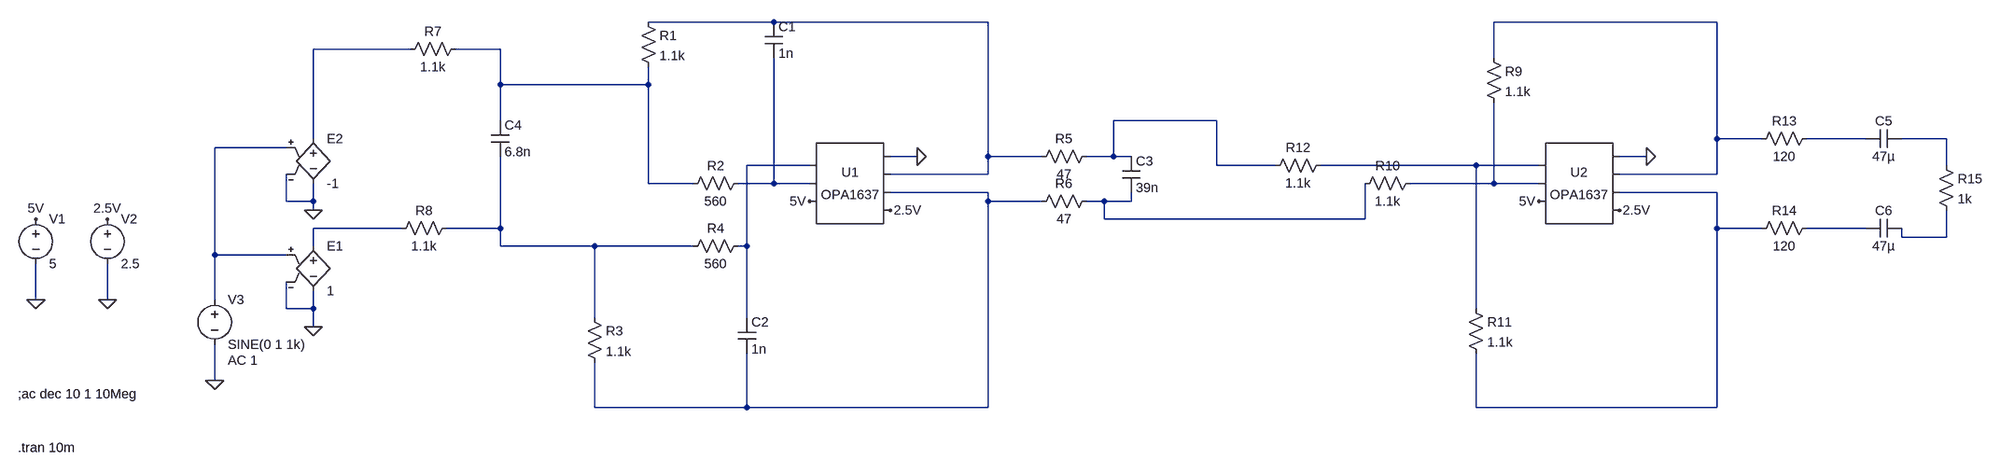
[diagram p0: schematic diff_amp_sim_output1.asc]
diff_amp_sim_output1.asc, the LTspice schematic file:
Version 4
SHEET 1 2404 680
WIRE 32 -112 -192 -112
WIRE 416 -112 32 -112
WIRE 1888 -112 1488 -112
WIRE -800 -64 -1264 -64
WIRE -640 -64 -720 -64
WIRE 1488 -48 1488 -112
WIRE -640 0 -640 -64
WIRE -192 0 -192 -32
WIRE -192 0 -640 0
WIRE -640 64 -640 0
WIRE 896 64 640 64
WIRE -1264 96 -1264 -64
WIRE 1888 96 1888 -112
WIRE 1968 96 1888 96
WIRE 2192 96 2048 96
WIRE 2336 96 2256 96
WIRE -1312 112 -1440 112
WIRE 288 128 240 128
WIRE 416 128 416 -112
WIRE 512 128 416 128
WIRE 640 128 640 64
WIRE 640 128 592 128
WIRE 672 128 640 128
WIRE 1760 128 1712 128
WIRE 96 144 -16 144
WIRE 896 144 896 64
WIRE 1088 144 896 144
WIRE 1456 144 1168 144
WIRE 1568 144 1456 144
WIRE 2336 144 2336 96
WIRE 416 160 416 128
WIRE 416 160 240 160
WIRE 1888 160 1888 96
WIRE 1888 160 1712 160
WIRE -192 176 -192 0
WIRE -112 176 -192 176
WIRE 32 176 32 -48
WIRE 32 176 -32 176
WIRE 96 176 32 176
WIRE 1488 176 1488 32
WIRE 1488 176 1328 176
WIRE 1568 176 1488 176
WIRE 416 192 240 192
WIRE 1888 192 1712 192
WIRE -1312 208 -1312 160
WIRE -1264 208 -1264 176
WIRE -1264 208 -1312 208
WIRE 416 208 416 192
WIRE 512 208 416 208
WIRE 624 208 592 208
WIRE 672 208 672 192
WIRE 672 208 624 208
WIRE -1264 224 -1264 208
WIRE 624 240 624 208
WIRE 1248 240 1248 176
WIRE 1248 240 624 240
WIRE -816 256 -1264 256
WIRE -640 256 -640 128
WIRE -640 256 -736 256
WIRE 1888 256 1888 192
WIRE 1968 256 1888 256
WIRE 2192 256 2048 256
WIRE 2256 272 2256 256
WIRE 2336 272 2336 224
WIRE 2336 272 2256 272
WIRE -1264 288 -1264 256
WIRE -640 288 -640 256
WIRE -288 288 -640 288
WIRE -112 288 -288 288
WIRE -16 288 -16 144
WIRE -16 288 -32 288
WIRE -1440 304 -1440 112
WIRE -1312 304 -1440 304
WIRE -1776 384 -1776 320
WIRE -1648 384 -1648 320
WIRE -1440 384 -1440 304
WIRE -1312 400 -1312 352
WIRE -1264 400 -1264 368
WIRE -1264 400 -1312 400
WIRE 1456 400 1456 144
WIRE -288 416 -288 288
WIRE -16 416 -16 288
WIRE -1264 432 -1264 400
WIRE -1440 528 -1440 464
WIRE -288 576 -288 496
WIRE -16 576 -16 480
WIRE -16 576 -288 576
WIRE 416 576 416 208
WIRE 416 576 -16 576
WIRE 1456 576 1456 480
WIRE 1888 576 1888 256
WIRE 1888 576 1456 576
FLAG -1776 384 0
FLAG -1776 240 5V
FLAG -1648 384 0
FLAG -1648 240 2.5V
FLAG 96 208 5V
FLAG 240 224 2.5V
FLAG -1440 528 0
FLAG -1264 432 0
FLAG -1264 224 0
FLAG 288 128 0
FLAG 1568 208 5V
FLAG 1712 224 2.5V
FLAG 1760 128 0
SYMBOL AutoGenerated\\OPA1637 160 176 R0
SYMATTR InstName U1
SYMBOL voltage -1776 224 R0
WINDOW 123 0 0 Left 0
WINDOW 39 0 0 Left 0
SYMATTR InstName V1
SYMATTR Value 5
SYMBOL voltage -1648 224 R0
WINDOW 123 0 0 Left 0
WINDOW 39 0 0 Left 0
SYMATTR InstName V2
SYMATTR Value 2.5
SYMBOL voltage -1440 368 R0
WINDOW 123 24 124 Left 2
WINDOW 39 0 0 Left 0
SYMATTR Value2 AC 1
SYMATTR InstName V3
SYMATTR Value SINE(0 1 1k)
SYMBOL e -1264 272 R0
SYMATTR InstName E1
SYMATTR Value 1
SYMBOL e -1264 80 R0
SYMATTR InstName E2
SYMATTR Value -1
SYMBOL res -704 -80 R90
WINDOW 0 0 56 VBottom 2
WINDOW 3 32 56 VTop 2
SYMATTR InstName R7
SYMATTR Value 1.1k
SYMBOL res -720 240 R90
WINDOW 0 0 56 VBottom 2
WINDOW 3 32 56 VTop 2
SYMATTR InstName R8
SYMATTR Value 1.1k
SYMBOL cap -656 64 R0
SYMATTR InstName C4
SYMATTR Value 6.8n
SYMBOL cap 16 -112 R0
SYMATTR InstName C1
SYMATTR Value 1n
SYMBOL res -208 -128 R0
SYMATTR InstName R1
SYMATTR Value 1.1k
SYMBOL res -16 160 R90
WINDOW 0 0 56 VBottom 2
WINDOW 3 32 56 VTop 2
SYMATTR InstName R2
SYMATTR Value 560
SYMBOL cap -32 416 R0
SYMATTR InstName C2
SYMATTR Value 1n
SYMBOL res -304 400 R0
SYMATTR InstName R3
SYMATTR Value 1.1k
SYMBOL res -16 272 R90
WINDOW 0 0 56 VBottom 2
WINDOW 3 32 56 VTop 2
SYMATTR InstName R4
SYMATTR Value 560
SYMBOL cap 656 128 R0
SYMATTR InstName C3
SYMATTR Value 39n
SYMBOL res 608 112 R90
WINDOW 0 0 56 VBottom 2
WINDOW 3 32 56 VTop 2
SYMATTR InstName R5
SYMATTR Value 47
SYMBOL res 608 192 R90
WINDOW 0 0 56 VBottom 2
WINDOW 3 32 56 VTop 2
SYMATTR InstName R6
SYMATTR Value 47
SYMBOL cap 2256 80 R90
WINDOW 0 0 32 VBottom 2
WINDOW 3 32 32 VTop 2
SYMATTR InstName C5
SYMATTR Value 47µ
SYMBOL cap 2256 240 R90
WINDOW 0 0 32 VBottom 2
WINDOW 3 32 32 VTop 2
SYMATTR InstName C6
SYMATTR Value 47µ
SYMBOL AutoGenerated\\OPA1637 1632 176 R0
SYMATTR InstName U2
SYMBOL res 1472 -64 R0
SYMATTR InstName R9
SYMATTR Value 1.1k
SYMBOL res 1344 160 R90
WINDOW 0 0 56 VBottom 2
WINDOW 3 32 56 VTop 2
SYMATTR InstName R10
SYMATTR Value 1.1k
SYMBOL res 1440 384 R0
SYMATTR InstName R11
SYMATTR Value 1.1k
SYMBOL res 1184 128 R90
WINDOW 0 0 56 VBottom 2
WINDOW 3 32 56 VTop 2
SYMATTR InstName R12
SYMATTR Value 1.1k
SYMBOL res 2064 80 R90
WINDOW 0 0 56 VBottom 2
WINDOW 3 32 56 VTop 2
SYMATTR InstName R13
SYMATTR Value 120
SYMBOL res 2064 240 R90
WINDOW 0 0 56 VBottom 2
WINDOW 3 32 56 VTop 2
SYMATTR InstName R14
SYMATTR Value 120
SYMBOL res 2320 128 R0
SYMATTR InstName R15
SYMATTR Value 1k
TEXT -1808 552 Left 2 !;ac dec 10 1 10Meg
TEXT -1808 648 Left 2 !.tran 10m

The netlist it stands for:
* diff_amp_sim_output1.asc
* U1: OPA1637 (symbol AutoGenerated\OPA1637 not available, pins judged from their places): pin1=N009 pin2=N011 pin3=5V pin4=0 pin5=N001 pin6=N013 pin7=2.5V
V1 5V 0 5
V2 2.5V 0 2.5
V3 N008 0 SINE(0 1 1k) AC 1
E1 N016 0 N008 0 1
E2 N003 0 N008 0 -1
R7 N004 N003 1.1k
R8 N017 N016 1.1k
C4 N004 N017 6.8n
C1 N001 N011 1n
R1 N001 N004 1.1k
R2 N011 N004 560
C2 N009 N013 1n
R3 N017 N013 1.1k
R4 N009 N017 560
C3 N005 N015 39n
R5 N005 N001 47
R6 N015 N013 47
C5 N007 N006 47µ
C6 N019 N018 47µ
* U2: OPA1637 (symbol AutoGenerated\OPA1637 not available, pins judged from their places): pin1=N010 pin2=N012 pin3=5V pin4=0 pin5=N002 pin6=N014 pin7=2.5V
R9 N002 N012 1.1k
R10 N012 N015 1.1k
R11 N010 N014 1.1k
R12 N010 N005 1.1k
R13 N006 N002 120
R14 N018 N014 120
R15 N007 N019 1k
;ac dec 10 1 10Meg
.tran 10m
.backanno
.end